# EAGLE design XYSunConnectors (EAGLE 9.6.2)
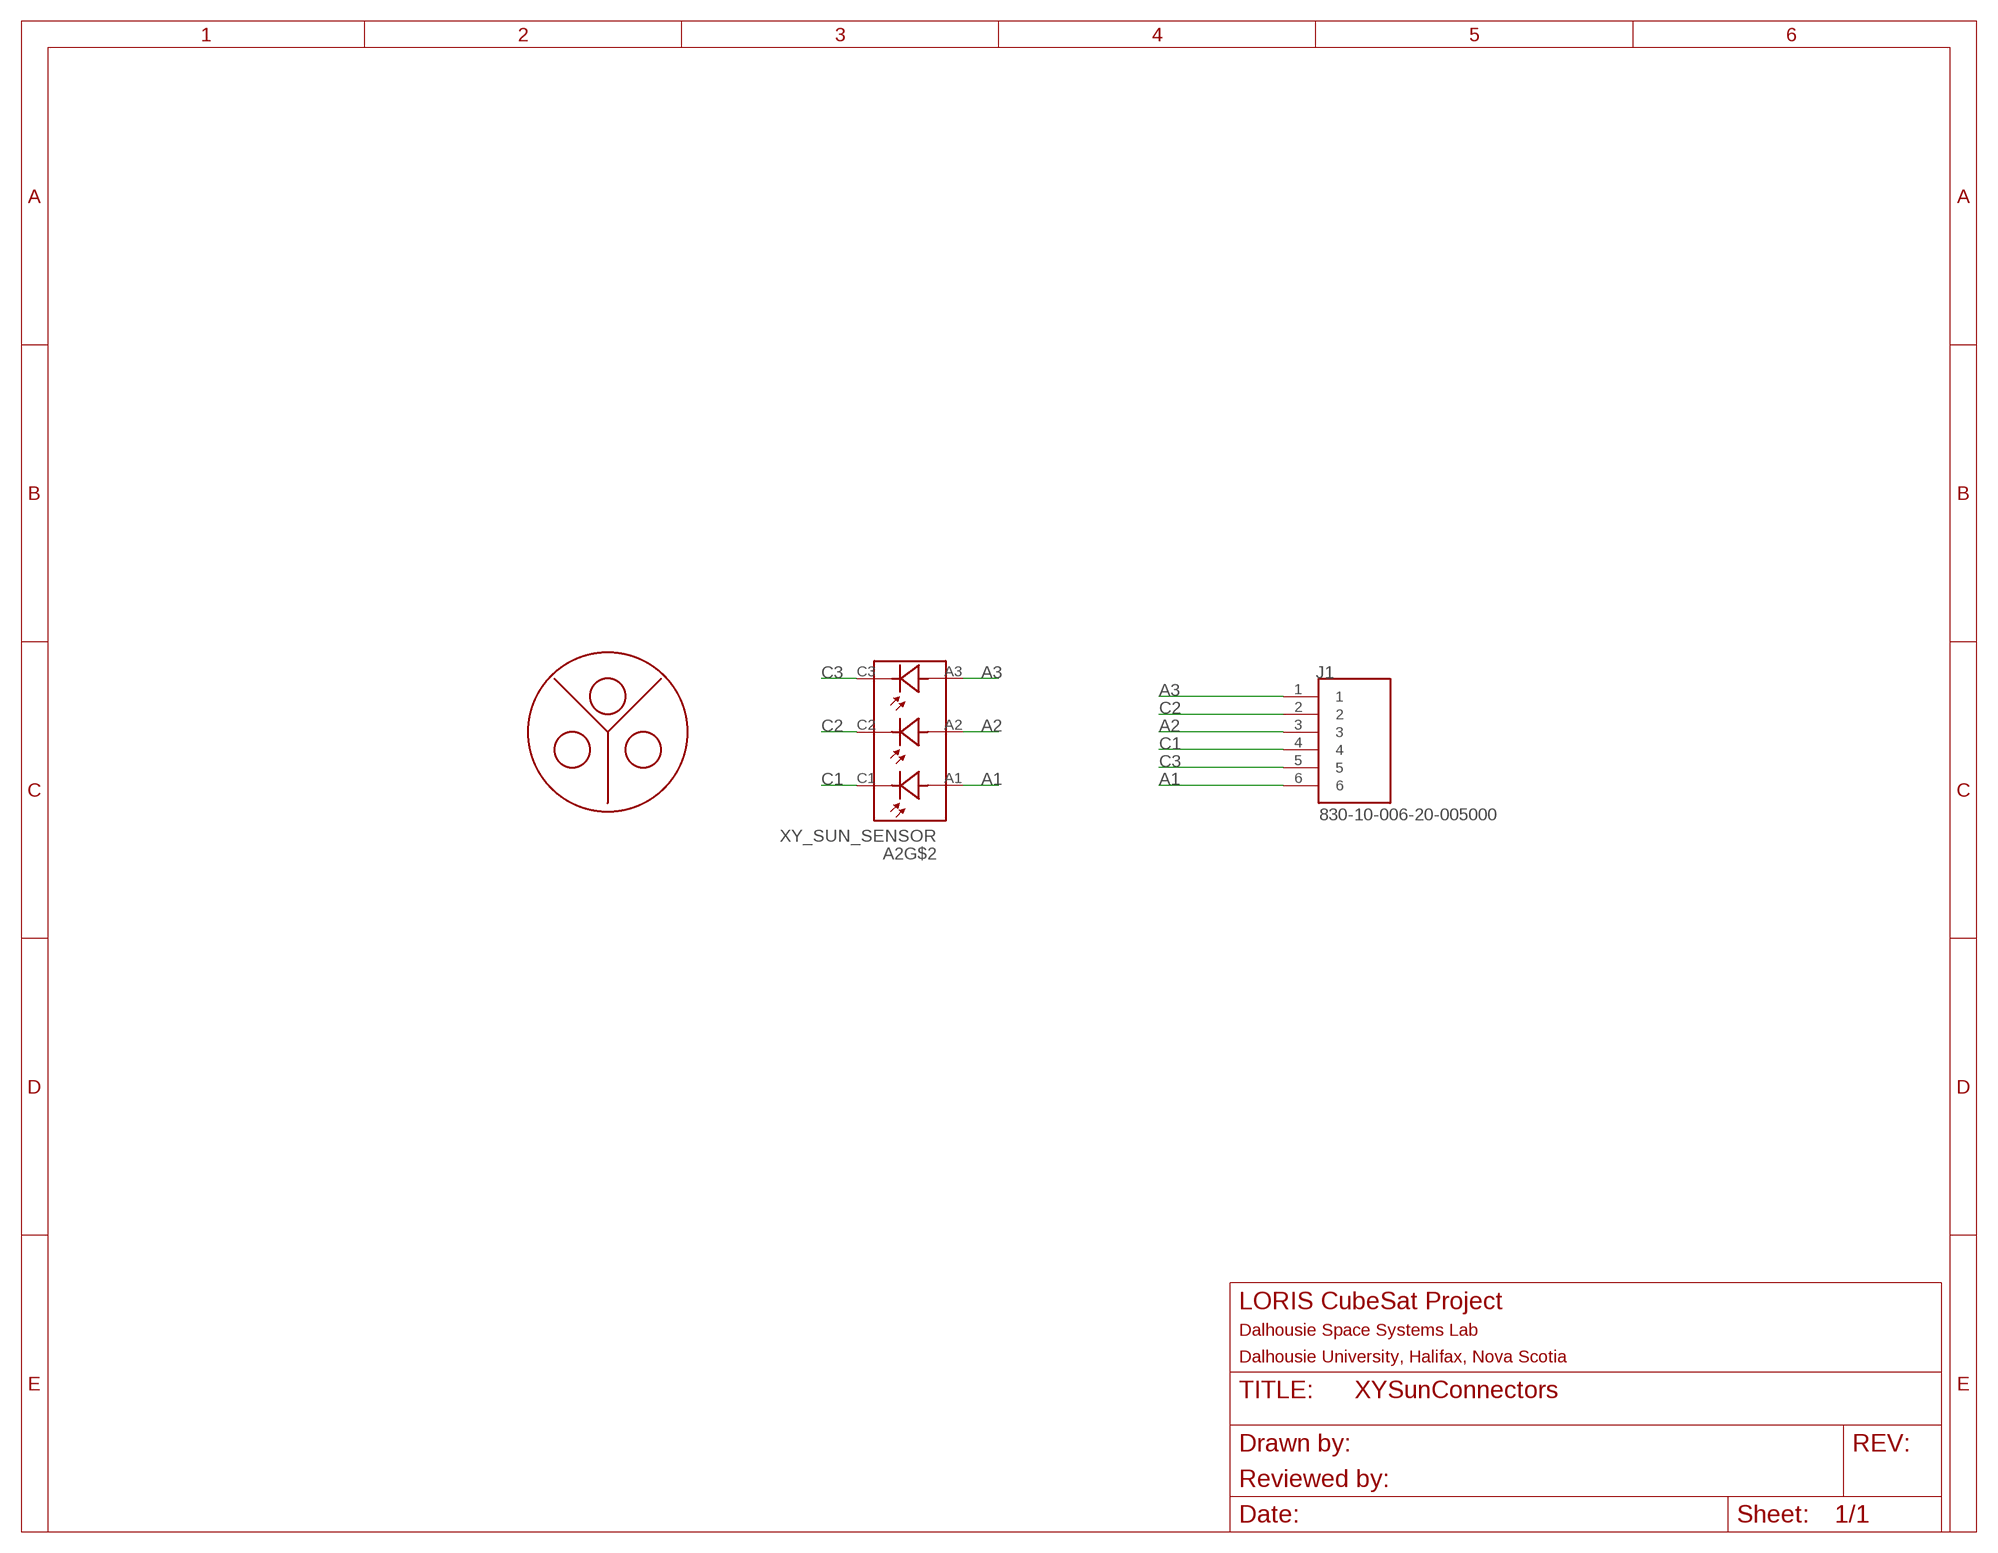
[diagram p0: schematic, sheet 1]

## Parts
A2  XY_SUN_SENSOR  [XY_SUN_SENOR_MASK]
J1  830-10-006-20-005000  [830-10-006-20-005000]

## Nets
A1: A2.A1 J1.6
A2: A2.A2 J1.3
A3: A2.A3 J1.1
C1: A2.C1 J1.4
C2: A2.C2 J1.2
C3: A2.C3 J1.5

## Library data of the parts
A2 = my_library:XY_SUN_SENSOR
J1 = 830-10-006-20-005000:830-10-006-20-005000: Check prices <https://pricing.snapeda.com/parts/2355104-4/TE%20Connectivity/view-part?ref=eda>; AVAILABILITY: In Stock; COMMENT: 2355104-4; DESCRIPTION: Pin 4P,2MM,BRK HDR,SRVT,2.8,0.1AU,TB W/CAP 4 POS; MF: TE Connectivity; MP: 2355104-4; PACKAGE: None; PRICE: None; PURCHASE-URL: https://pricing.snapeda.com/search/part/2355104-4/?ref=eda

## Board
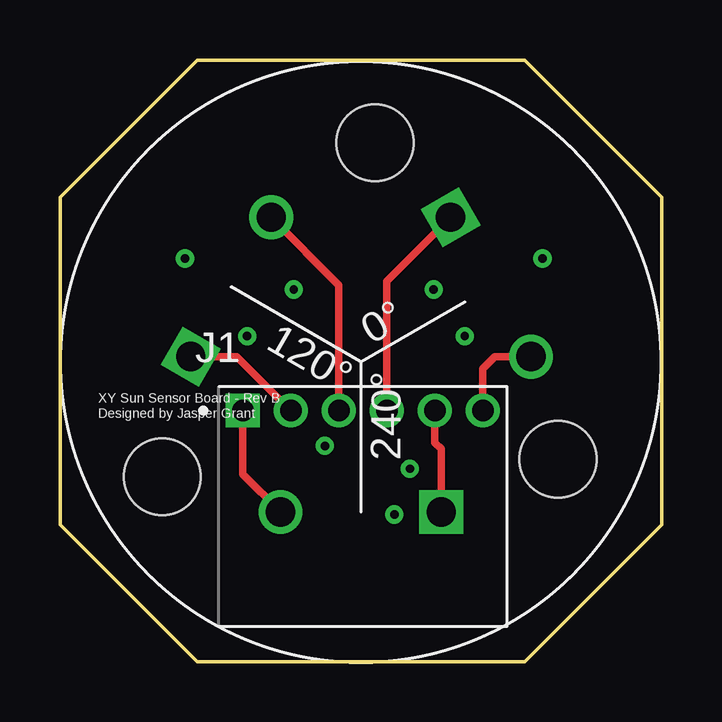
[diagram p1: board, top side]
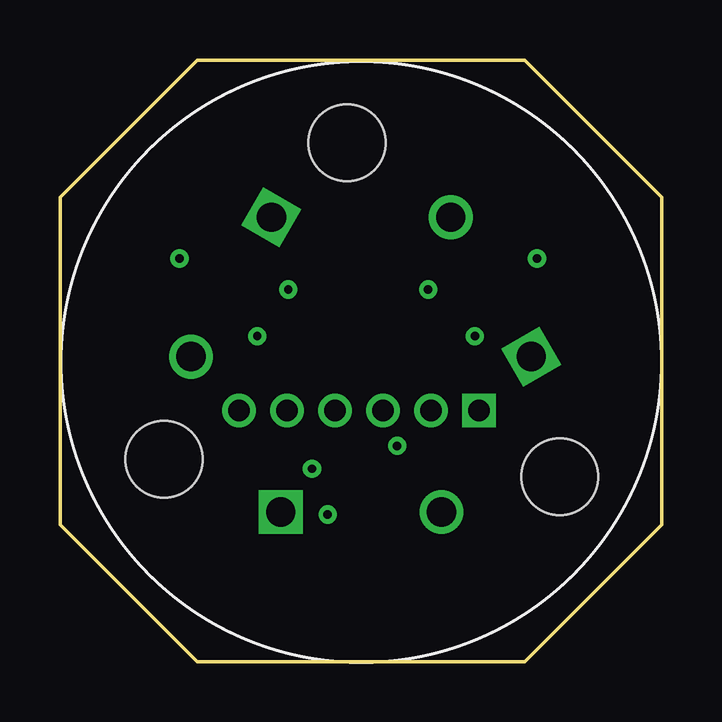
[diagram p2: board, bottom side, seen from below]

Size 25.08 x 25.08 mm. Coordinates in mm from the lower left corner, seen from the top.
Outline: 5.71,0 19.37,0 25.08,5.72 25.08,19.37 19.37,25.08 5.71,25.08 0,19.37 0,5.72 5.71,0
Copper layers (1*16): Top 0.035mm / dielectric 1.5mm / Bottom 0.035mm
Design rules "default *": minimum track width 6mil, minimum drill 0.35mm, track to track 6mil, track to pad 6mil, pad to pad 6mil, via to via 6mil, smd to smd 6mil, copper to edge 10mil, drill to drill 6mil, minimum pad ring 10mil, minimum via ring 8mil, stop-mask expansion 4mil, vias tented up to drill 0mil, thermal gap 10mil

### Footprints (pad centres in the part's own frame; a part is rotated, then mirrored left to right if it is on the bottom)
XY_SUN_SENOR_MASK = drill 1.219: A1 6.25,-3.35; A2 -0.224,7.088; A3 -6.026,-3.738 | drill 1.219 square: C1 6.25,3.35; C2 -6.026,3.738; C3 -0.224,-7.088 | hole 3.2: 5.08,-7.62; -9.56,0; 5.08,7.62
830-10-006-20-005000 = drill 0.9 pad 1.25 square: 1 0,0 | drill 0.9 pad 1.25: 2 2,0; 3 4,0; 4 6,0; 5 8,0; 6 10,0

### Placement (x,y rotation side)
A2  12.54,12.5 30 top
J1  7.62,10.48 0 top

### Tracks (layer width: path | path; a pad name or v marks a point on that pad's centre or on a via)
A1
  Top 0.305: J1.6 17.62,12.22 18.12,12.72 A2.A1
A2
  Top 0.305: J1.3 11.62,15.71 A2.A2
A3
  Top 0.305: J1.1 7.62,7.82 A2.A3
C1
  Top 0.305: J1.4 13.62,15.87 A2.C1
C2
  Top 0.305: J1.2 7.37,12.72 A2.C2
C3
  Top 0.305: J1.5 15.62,9.14 15.89,8.88 A2.C3
N$7  (via drill 0.35)
  other vias: 5.21,16.81
N$8  (via drill 0.35)
  other vias: 9.74,15.52
N$9  (via drill 0.35)
  other vias: 7.8,13.58
N$10  (via drill 0.35)
  other vias: 15.57,15.52
N$11  (via drill 0.35)
  other vias: 16.87,13.58
N$12  (via drill 0.35)
  other vias: 20.1,16.81
N$13  (via drill 0.35)
  other vias: 13.93,6.15
N$14  (via drill 0.35)
  other vias: 11.04,9
N$15  (via drill 0.35)
  other vias: 14.58,8.05

### Text on the board
tNames: Designed by Jasper Grant | XY Sun Sensor Board - Rev B